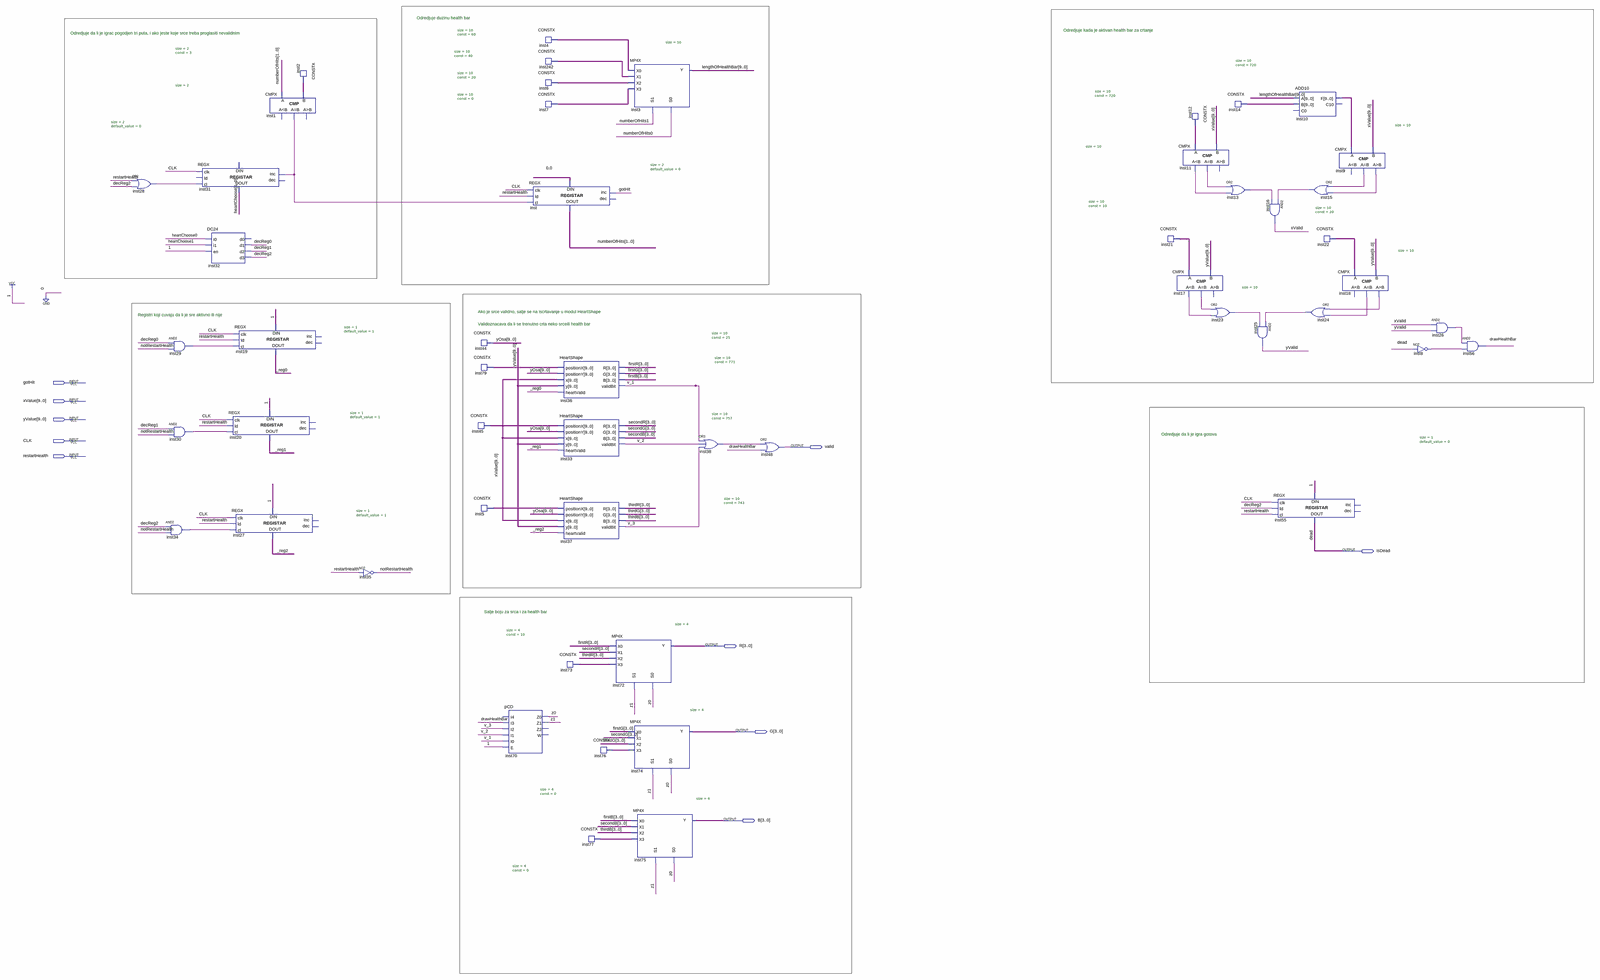
[diagram p0: schematic sheet, whole]
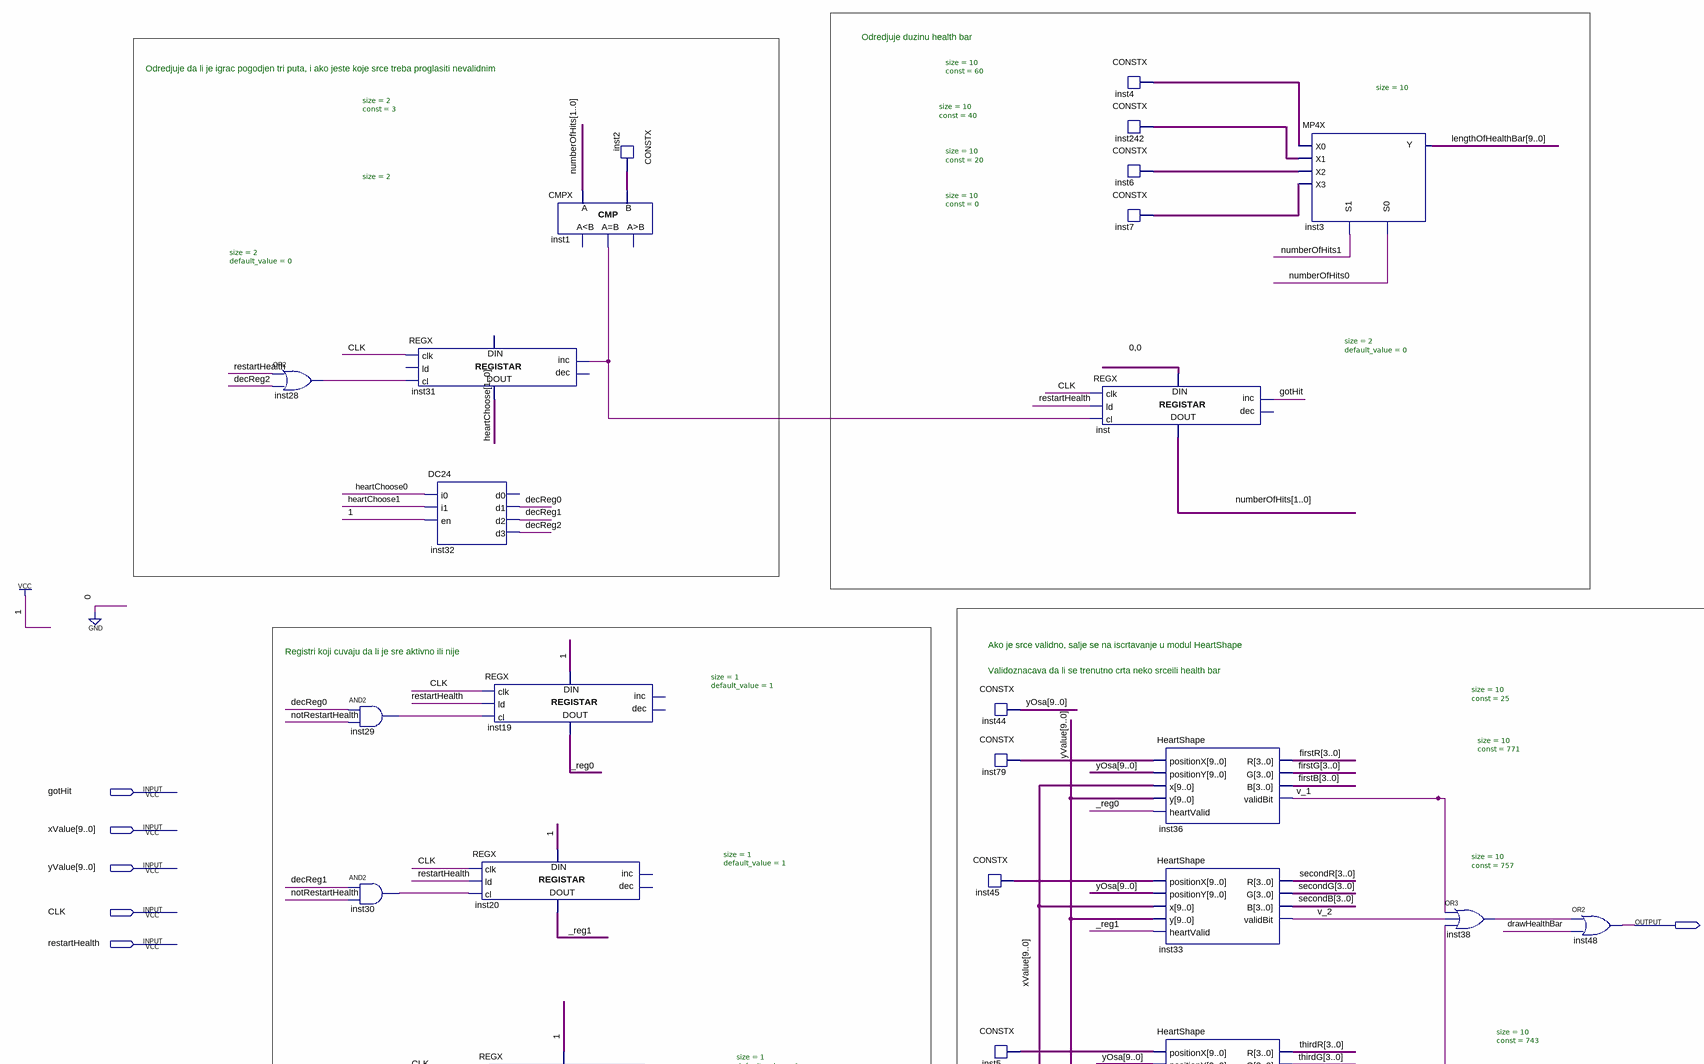
[diagram p1: schematic sheet, upper left part]
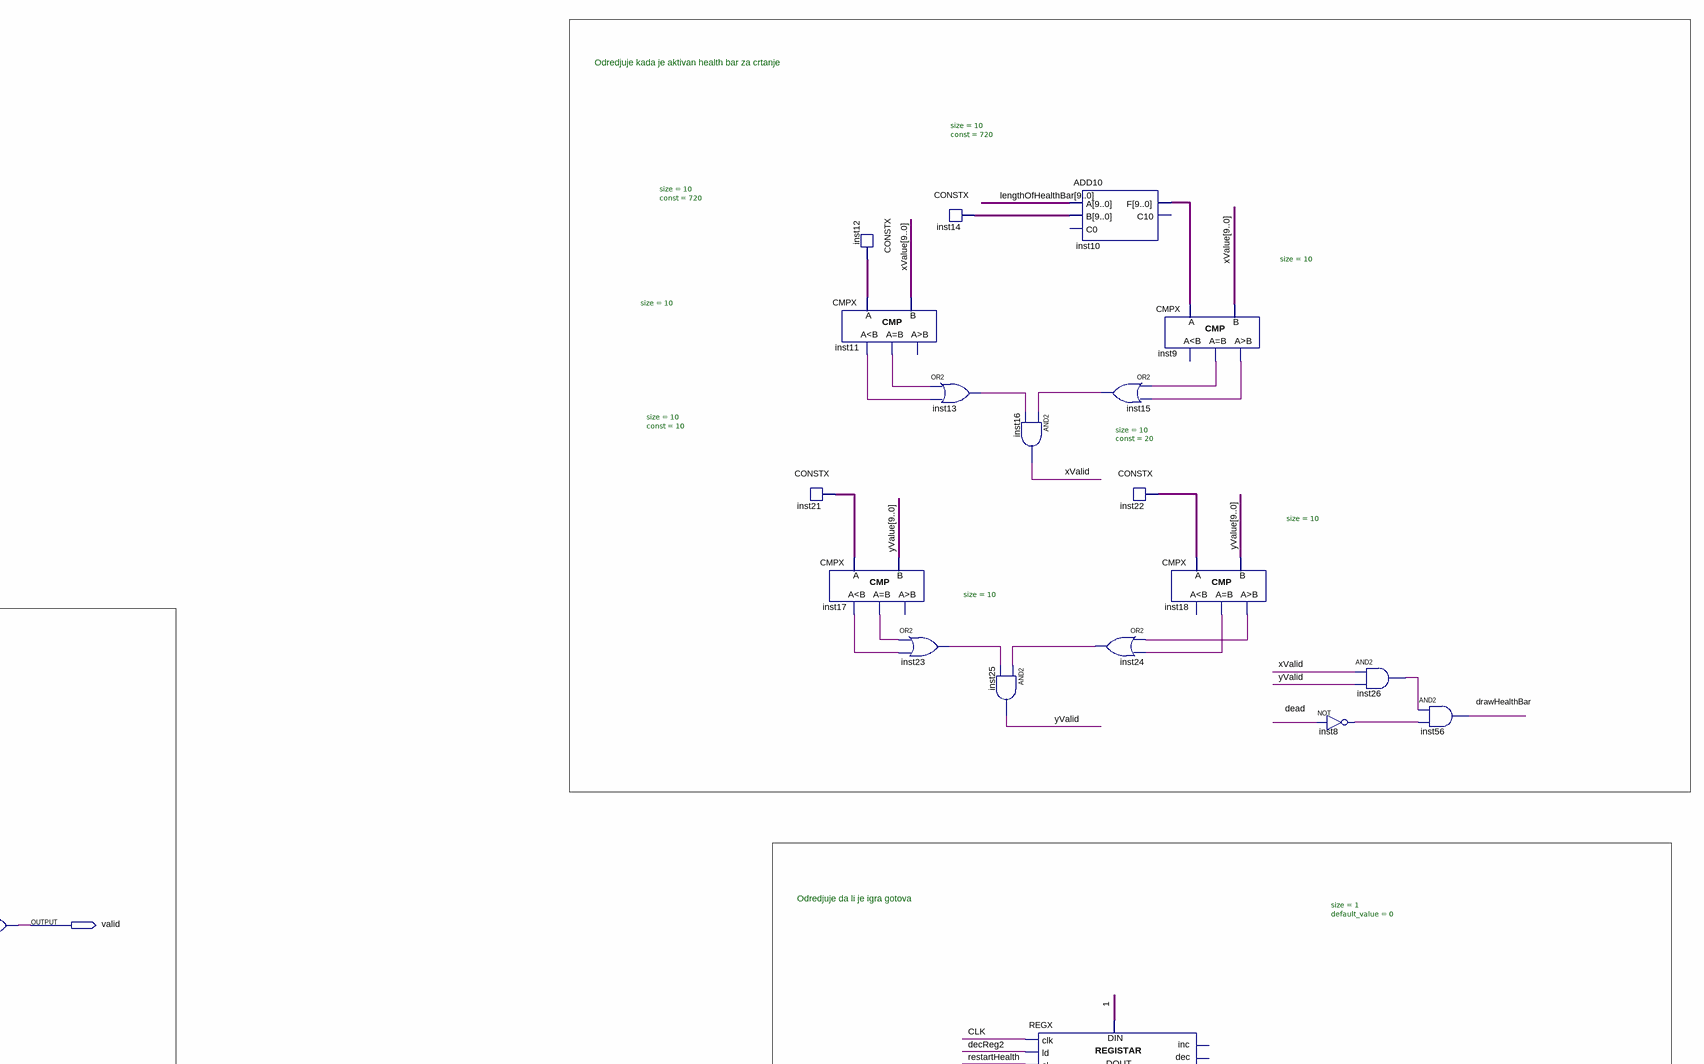
[diagram p2: schematic sheet, upper right part]
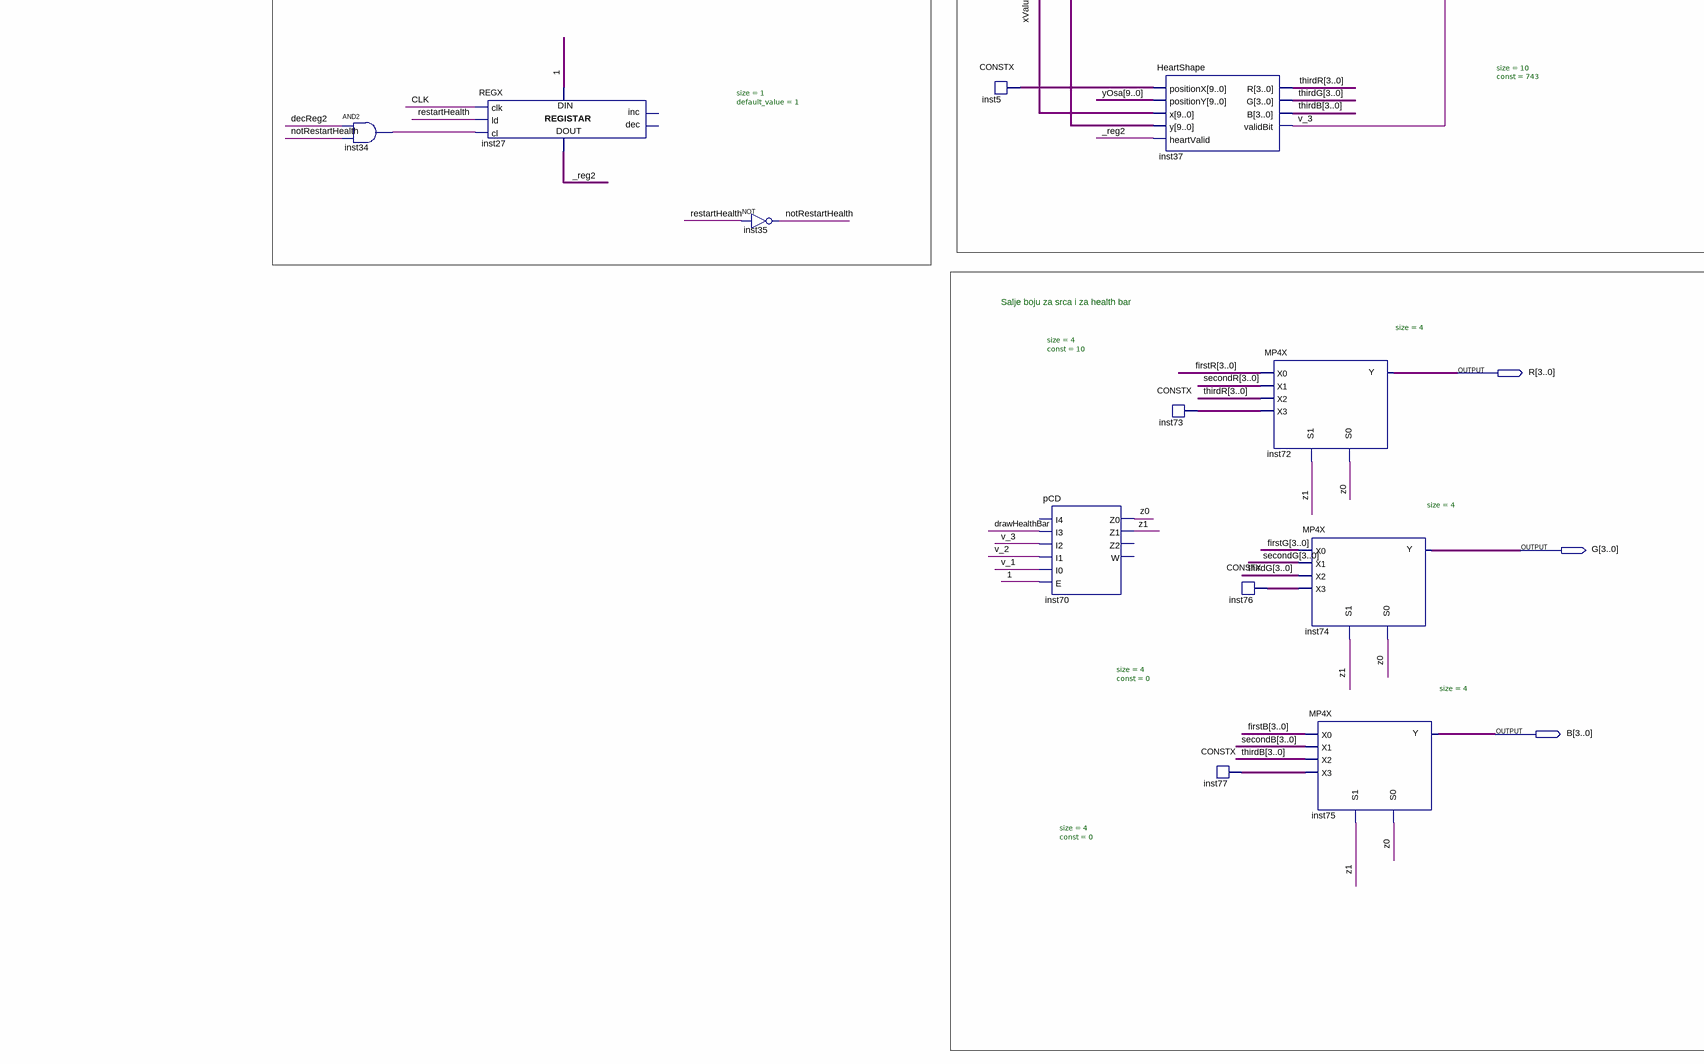
[diagram p3: schematic sheet, lower left part]
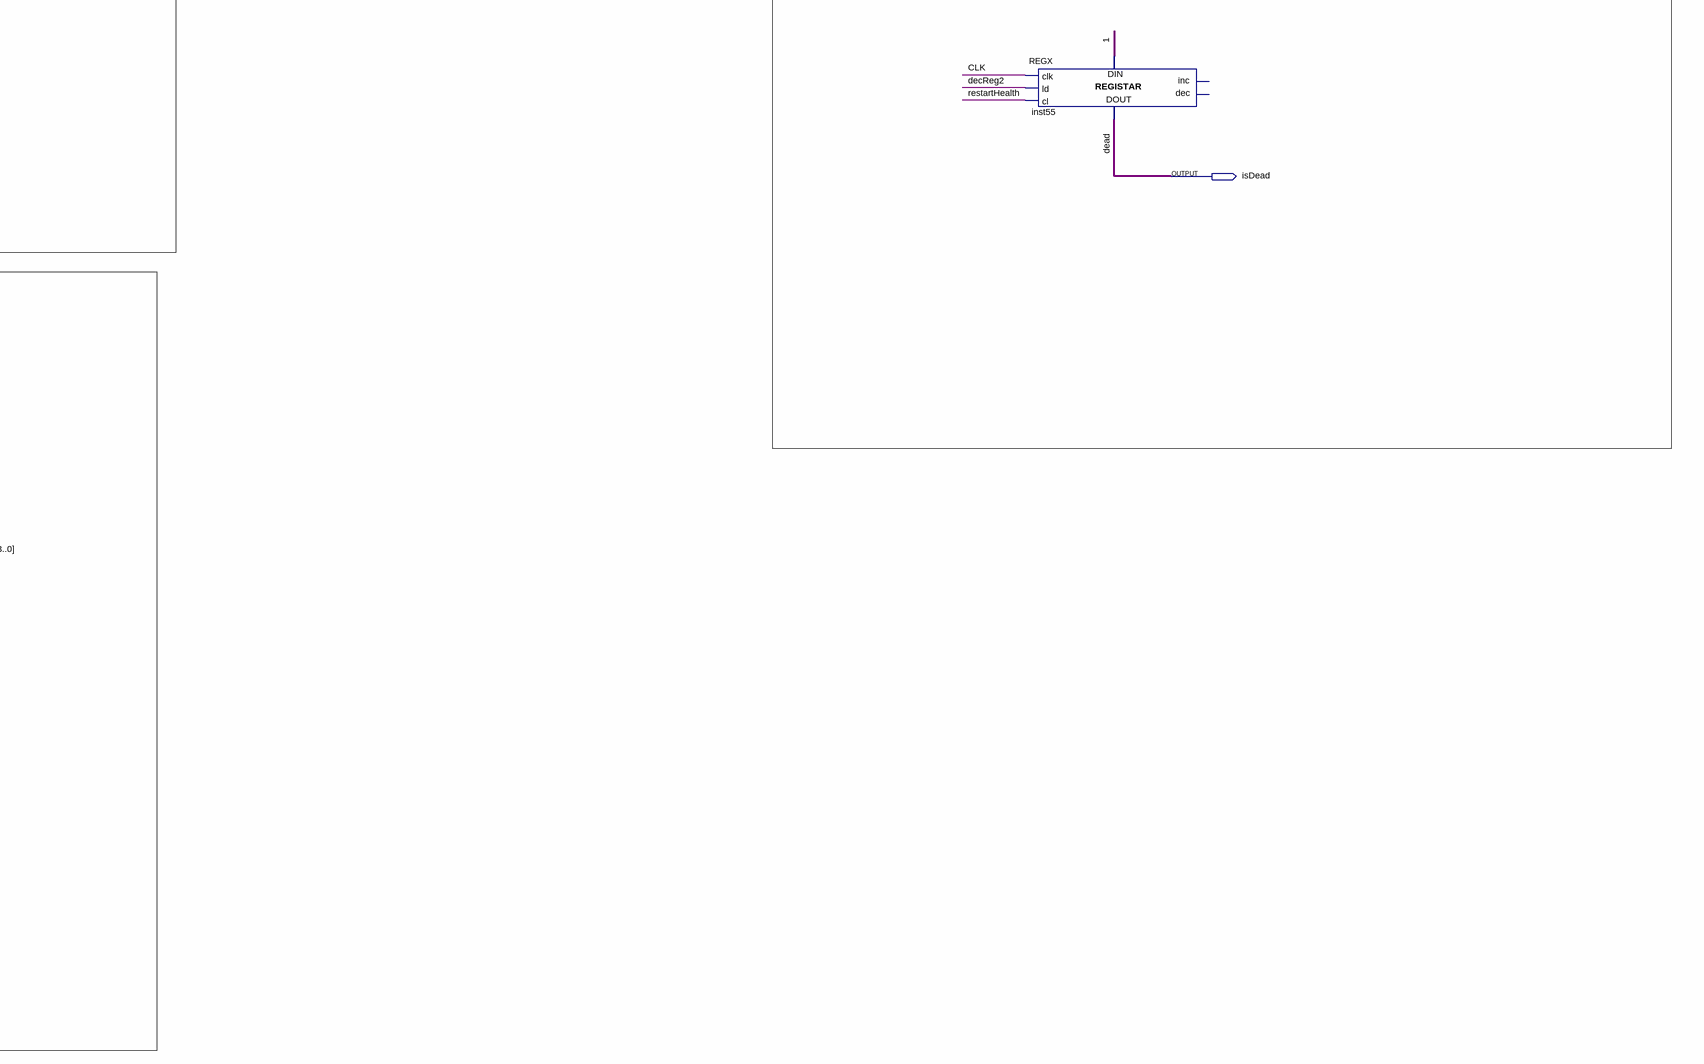
[diagram p4: schematic sheet, lower right part]
// Quartus schematic healthStatus.bdf as structural Verilog: 53 symbols, 10 pins
module healthStatus (
  input  gotHit,
  input  [9:0] xValue,
  input  [9:0] yValue,
  input  CLK,
  input  restartHealth,
  output valid,
  output isDead,
  output [3:0] R,
  output [3:0] G,
  output [3:0] B
);

  wire _reg0, _reg1, _reg2, decReg0, decReg1, decReg2, drawHealthBar, inst1_eq, inst8_out, inst9_eq,
       inst9_gr, inst11_eq, inst11_ls, inst13_out, inst15_out, inst17_eq, inst17_ls, inst18_eq, inst18_gr,
       inst23_out, inst24_out, inst26_out, inst28_out, inst29_out, inst30_out, inst34_out, inst38_out,
       notRestartHealth, v_1, v_2, v_3, xValid, yValid, z0, z1;
  wire [1:0] heartChoose, inst2_data, numberOfHits;
  wire [3:0] firstB, firstG, firstR, inst73_data, inst76_data, inst77_data, secondB, secondG, secondR,
       thirdB, thirdG, thirdR;
  wire [9:0] inst4_data, inst5_data, inst6_data, inst7_data, inst10_f, inst12_data, inst14_data, inst21_data,
       inst22_data, inst45_data, inst79_data, inst242_data, lengthOfHealthBar, yOsa;

  or inst28 (inst28_out, restartHealth, decReg2);
  and inst29 (inst29_out, decReg0, notRestartHealth);
  and inst30 (inst30_out, decReg1, notRestartHealth);
  and inst34 (inst34_out, decReg2, notRestartHealth);
  REGX #(.size(2), .default_value(0)) inst31 (
    .clk(CLK), .cl(inst28_out), .inc(inst1_eq), .data_out(heartChoose));  // open: ld, dec, data_in
  DC24 inst32 (
    .i0(heartChoose[0]), .i1(heartChoose[1]), .en(1'b1), .d1(decReg0), .d2(decReg1), .d3(decReg2));  // open: d0
  REGX #(.size(1), .default_value(1)) inst19 (
    .clk(CLK), .ld(restartHealth), .cl(inst29_out), .data_in(1'b1), .data_out(_reg0));  // open: inc, dec
  REGX #(.size(1), .default_value(1)) inst20 (
    .clk(CLK), .ld(restartHealth), .cl(inst30_out), .data_in(1'b1), .data_out(_reg1));  // open: inc, dec
  REGX #(.size(1), .default_value(1)) inst27 (
    .clk(CLK), .ld(restartHealth), .cl(inst34_out), .data_in(1'b1), .data_out(_reg2));  // open: inc, dec
  CMPX #(.size(2)) inst1 (.A(numberOfHits), .B(inst2_data), .eq(inst1_eq));  // open: ls, gr
  CONSTX #(.size(2), .\const (3)) inst2 (.data(inst2_data));
  not inst35 (notRestartHealth, restartHealth);
  CONSTX #(.size(10), .\const (757)) inst45 (.data(inst45_data));
  CONSTX #(.size(10), .\const (25)) inst44 (.data(yOsa));
  CONSTX #(.size(10), .\const (771)) inst79 (.data(inst79_data));
  CONSTX #(.size(10), .\const (743)) inst5 (.data(inst5_data));
  pCD inst70 (.I3(drawHealthBar), .I2(v_3), .I1(v_2), .I0(v_1), .E(1'b1), .Z0(z0), .Z1(z1));  // open: I4, Z2, W
  CONSTX #(.size(10), .\const (60)) inst4 (.data(inst4_data));
  CONSTX #(.size(10), .\const (40)) inst242 (.data(inst242_data));
  CONSTX #(.size(10), .\const (20)) inst6 (.data(inst6_data));
  CONSTX #(.size(10), .\const (0)) inst7 (.data(inst7_data));
  REGX #(.size(2), .default_value(0)) inst (
    .clk(CLK), .ld(restartHealth), .cl(inst1_eq), .inc(gotHit), .data_in(2'b00), .data_out(numberOfHits));  // open: dec
  HeartShape inst36 (
    .positionX(inst79_data), .positionY(yOsa), .x(xValue), .y(yValue), .heartValid(_reg0), .R(firstR),
    .G(firstG), .B(firstB), .validBit(v_1));
  HeartShape inst33 (
    .positionX(inst45_data), .positionY(yOsa), .x(xValue), .y(yValue), .heartValid(_reg1), .R(secondR),
    .G(secondG), .B(secondB), .validBit(v_2));
  HeartShape inst37 (
    .positionX(inst5_data), .positionY(yOsa), .x(xValue), .y(yValue), .heartValid(_reg2), .R(thirdR),
    .G(thirdG), .B(thirdB), .validBit(v_3));
  CONSTX #(.size(4), .\const (10)) inst73 (.data(inst73_data));
  CONSTX #(.size(4), .\const (0)) inst76 (.data(inst76_data));
  CONSTX #(.size(4), .\const (0)) inst77 (.data(inst77_data));
  MP4X #(.size(4)) inst72 (.X0(firstR), .X1(secondR), .X2(thirdR), .X3(inst73_data), .S1(z1), .S0(z0), .Y(R));
  MP4X #(.size(10)) inst3 (
    .X0(inst4_data), .X1(inst242_data), .X2(inst6_data), .X3(inst7_data), .S1(numberOfHits[1]),
    .S0(numberOfHits[0]), .Y(lengthOfHealthBar));
  MP4X #(.size(4)) inst74 (.X0(firstG), .X1(secondG), .X2(thirdG), .X3(inst76_data), .S1(z1), .S0(z0), .Y(G));
  MP4X #(.size(4)) inst75 (.X0(firstB), .X1(secondB), .X2(thirdB), .X3(inst77_data), .S1(z1), .S0(z0), .Y(B));
  or inst38 (inst38_out, v_1, v_2, v_3);
  or inst48 (valid, inst38_out, drawHealthBar);
  CMPX #(.size(10)) inst11 (.A(inst12_data), .B(xValue), .ls(inst11_ls), .eq(inst11_eq));  // open: gr
  CONSTX #(.size(10), .\const (10)) inst21 (.data(inst21_data));
  CMPX #(.size(10)) inst17 (.A(inst21_data), .B(yValue), .ls(inst17_ls), .eq(inst17_eq));  // open: gr
  CONSTX #(.size(10), .\const (720)) inst12 (.data(inst12_data));
  CONSTX #(.size(10), .\const (720)) inst14 (.data(inst14_data));
  or inst13 (inst13_out, inst11_eq, inst11_ls);
  or inst23 (inst23_out, inst17_eq, inst17_ls);
  and inst25 (yValid, inst24_out, inst23_out);
  and inst16 (xValid, inst15_out, inst13_out);
  REGX #(.size(1), .default_value(0)) inst55 (
    .clk(CLK), .ld(decReg2), .cl(restartHealth), .data_in(1'b1), .data_out(isDead));  // open: inc, dec
  ADD10 inst10 (.A(lengthOfHealthBar), .B(inst14_data), .F(inst10_f));  // open: C0, C10
  or inst15 (inst15_out, inst9_eq, inst9_gr);
  CONSTX #(.size(10), .\const (20)) inst22 (.data(inst22_data));
  or inst24 (inst24_out, inst18_gr, inst18_eq);
  CMPX #(.size(10)) inst9 (.A(inst10_f), .B(xValue), .eq(inst9_eq), .gr(inst9_gr));  // open: ls
  CMPX #(.size(10)) inst18 (.A(inst22_data), .B(yValue), .eq(inst18_eq), .gr(inst18_gr));  // open: ls
  not inst8 (inst8_out, isDead);
  and inst26 (inst26_out, xValid, yValid);
  and inst56 (drawHealthBar, inst26_out, inst8_out);

  // Other names for the same wires on the sheet: dead = isDead

  // Notes on the sheet:
  //   Odredjuje duzinu health bar                                                        
  //   Odredjuje kada je aktivan health bar za crtanje                              
  //   Odredjuje da li je igrac pogodjen tri puta, i ako jeste koje srce treba proglasiti nevalidnim                     
  //   Ako je srce validno, salje se na iscrtavanje u modul HeartShape
  //   Registri koji cuvaju da li je sre aktivno ili nije                        
  //   Validoznacava da li se trenutno crta neko srceili health bar                        
  //   Odredjuje da li je igra gotova
  //   Salje boju za srca i za health bar                          
endmodule
